# Altium schematic sheet Procesador Principal.SchDoc
size A4
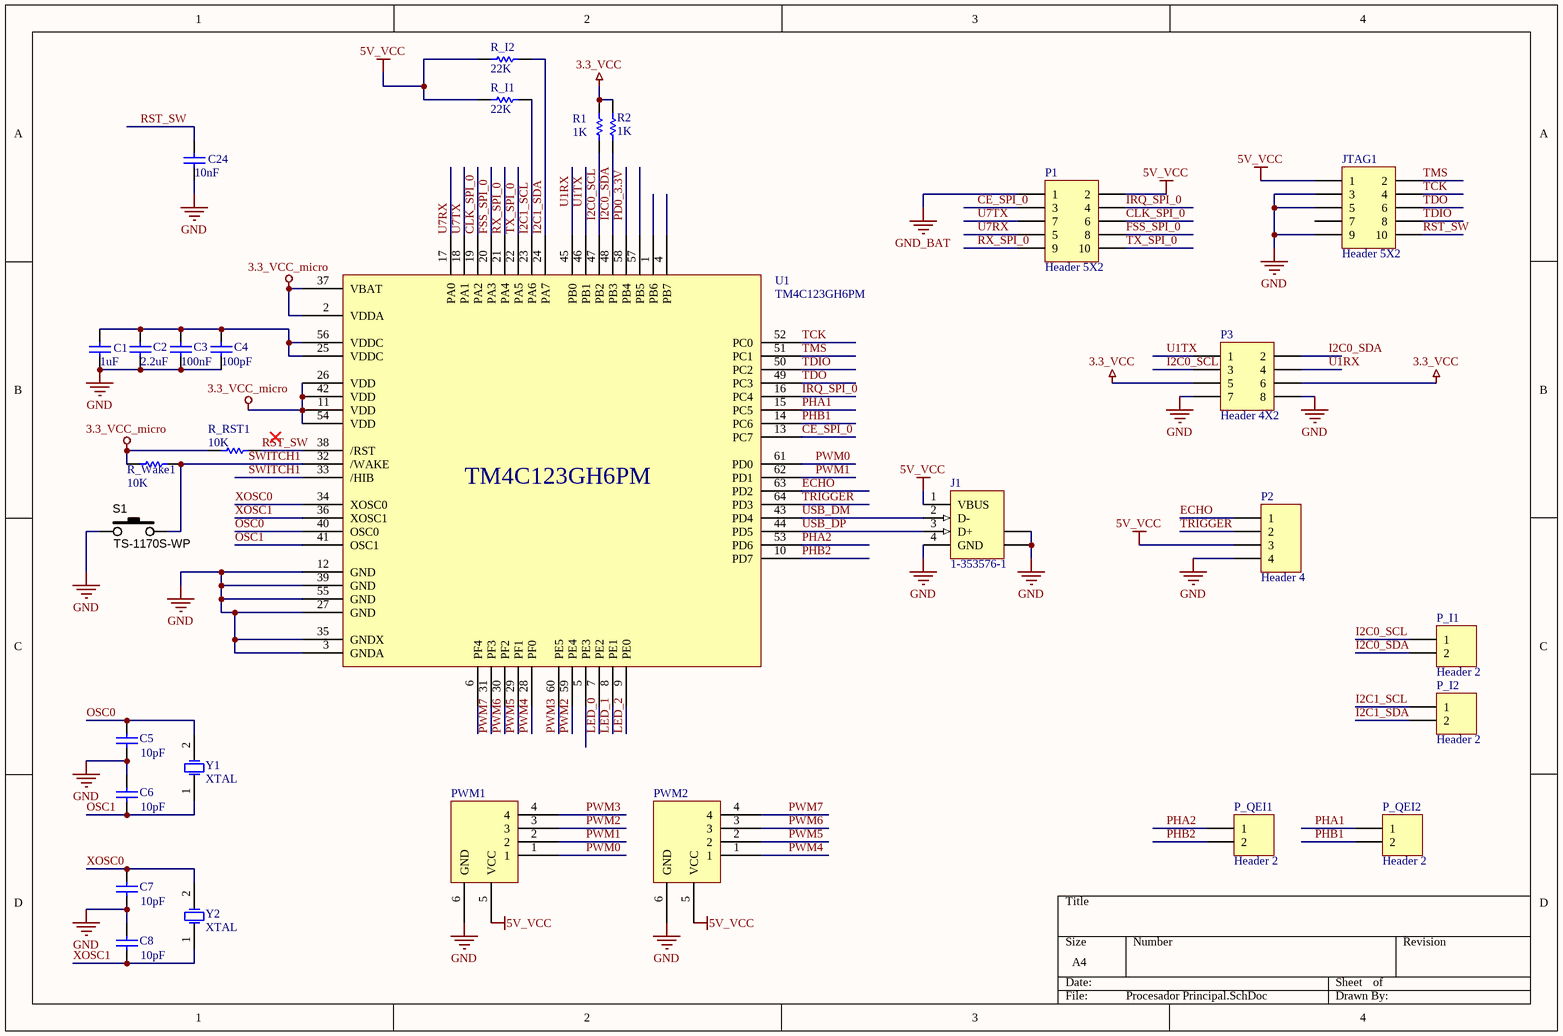
[diagram p0: Procesador Principal.SchDoc]

## Parts
C1  value 1uF  [6-0805_L]  (hidden comment: Cap)
C2  value 2.2uF  [6-0805_L]  (hidden comment: Cap)
C3  value 100nF  [6-0805_L]  (hidden comment: Cap)
C4  value 100pF  [6-0805_L]  (hidden comment: Cap)
C5  value 10pF  [C0805]  (hidden comment: Cap)
C6  value 10pF  [C0805]  (hidden comment: Cap)
C7  value 10pF  [C0805]  (hidden comment: Cap)
C8  value 10pF  [C0805]  (hidden comment: Cap)
C24  value 10nF  [6-0805_L]  (hidden comment: Cap)
J1  1-353576-1  [Micro USB]
JTAG1  Header 5X2  [HDR2X5]
P1  Header 5X2  [SMD_HEADER 5x2]
P2  Header 4  [HDR1X4]
P3  Header 4X2  [SMD_HEADER 4x2]
P_I1  Header 2  [HDR1X2]
P_I2  Header 2  [HDR1X2]
P_QEI1  Header 2  [HDR1X2]
P_QEI2  Header 2  [HDR1X2]
PWM1  Header 4 x 3  [Header_4x3_mirror]  (value not drawn)
PWM2  Header 4 x 3  [Header_4x3]  (value not drawn)
R1  value 1K  [C0805]  (hidden comment: Res1)
R2  value 1K  [6-0805_L]  (hidden comment: Res1)
R_I1  value 22K  [C1206]  (hidden comment: Res1)
R_I2  value 22K  [C1206]  (hidden comment: Res1)
R_RST1  value 10K  [C1206]  (hidden comment: Res1)
R_Wake1  value 10K  [C0805]  (hidden comment: Res1)
S1  TS-1170S-WP  [TS-1170S]
U1  TM4C123GH6PM  [SQFP50P1200X1200-64L]
Y1  XTAL  [CFPX-5]
Y2  XTAL  [BCY-W2/D2.1]

## Nets
3.3_VCC: P3.5 P3.6 R1.1 R2.2
3.3_VCC_micro: R_RST1.1 R_Wake1.1 U1.2(VDDA) U1.11(VDD) U1.26(VDD) U1.37(VBAT) U1.42(VDD) U1.54(VDD)
5V_VCC: J1.1(VBUS) JTAG1.1 P1.2 P2.3 PWM1.5(VCC) PWM2.5(VCC) R_I1.2 R_I2.2
GND: C1.1 C2.1 C3.1 C4.1 C5.1 C6.2 C7.1 C8.2 C24.1 J1.4(GND) J1.5(SHLD) J1.6(SHLD) JTAG1.3 JTAG1.5 JTAG1.9 P2.4 P3.7 P3.8 PWM1.6(GND) PWM2.6(GND) S1.1 U1.3(GNDA) U1.12(GND) U1.27(GND) U1.35(GNDX) U1.39(GND) U1.55(GND)
GND_BAT: P1.1
CE_SPI_0: P1.3 U1.13(PC7)
CLK_SPI_0: P1.6 U1.19(PA2)
ECHO: P2.1 U1.63(PD2)
FSS_SPI_0: P1.8 U1.20(PA3)
I2C0_SCL: P3.3 P_I1.1 R1.2 U1.47(PB2)
I2C0_SDA: P3.2 P_I1.2 R2.1 U1.48(PB3)
I2C1_SCL: P_I2.1 R_I1.1 U1.23(PA6)
I2C1_SDA: P_I2.2 R_I2.1 U1.24(PA7)
IRQ_SPI_0: P1.4 U1.16(PC4)
LED_0: U1.7(PE2)
LED_1: U1.8(PE1)
LED_2: U1.9(PE0)
OSC0: C5.2 U1.40(OSC0) Y1.2(OSC2)
OSC1: C6.1 U1.41(OSC1) Y1.1(OSC1)
PD0_3.3V: U1.58(PB4)
PHA1: P_QEI2.1 U1.15(PC5)
PHA2: P_QEI1.1 U1.53(PD6)
PHB1: P_QEI2.2 U1.14(PC6)
PHB2: P_QEI1.2 U1.10(PD7)
PWM0: PWM1.1 U1.61(PD0)
PWM1: PWM1.2 U1.62(PD1)
PWM2: PWM1.3 U1.59(PE4)
PWM3: PWM1.4 U1.60(PE5)
PWM4: PWM2.1 U1.28(PF0)
PWM5: PWM2.2 U1.29(PF1)
PWM6: PWM2.3 U1.30(PF2)
PWM7: PWM2.4 U1.31(PF3)
RST_SW: C24.2 JTAG1.10 R_RST1.2 U1.38(/RST)
RX_SPI_0: P1.9 U1.21(PA4)
SWITCH1: R_Wake1.2 S1.2 U1.32(/WAKE) U1.33(/HIB)
TCK: JTAG1.4 U1.52(PC0)
TDIO: JTAG1.8 U1.50(PC2)
TDO: JTAG1.6 U1.49(PC3)
TMS: JTAG1.2 U1.51(PC1)
TRIGGER: P2.2 U1.64(PD3)
TX_SPI_0: P1.10 U1.22(PA5)
U1RX: P3.4 U1.45(PB0)
U1TX: P3.1 U1.46(PB1)
U7RX: P1.5 U1.17(PA0)
U7TX: P1.7 U1.18(PA1)
USB_DM: J1.2(D-) U1.43(PD4)
USB_DP: J1.3(D+) U1.44(PD5)
XOSC0: C7.2 U1.34(XOSC0) Y2.2(OSC2)
XOSC1: C8.1 U1.36(XOSC1) Y2.1(OSC1)
NetC1_2: C1.2 C2.2 C3.2 C4.2 U1.25(VDDC) U1.56(VDDC)

Not connected (* = marked no-connect by the designer): JTAG1 7; U1 1(PB6) 4(PB7) 5(PE3) 6(PF4) 57(PB5)

## Library data of the parts
C1-C8 C24 = Cap: Capacitor; Published: 8-Jun-2000; LatestRevisionDate: 17-Jul-2002; LatestRevisionNote: Re-released for DXP Platform.; PackageReference: RAD-0.3; Publisher: Altium Limited; PackageDescription: Radial Cap, Thru-Hole; 2 Leads; 0.3 in Pin Spacing
J1 = 1-353576-1: USB 1.1, Right Angle, SMT, A Type, Receptacle, 4 Position, White; ContactMaterial: Copper Alloy; ContactPlating: Gold over Palladium Nickel; PCB_Layout: Complies with manufacturer's recommendation.; DrillSize: Corresponds to nominal value.; PanelGround: Without; Published: 15-Jul-2004; DatasheetDocument: 11-Apr-2003; PackageDocument: 11-Apr-2003; PackageReference: 353576; Publisher: Altium Limited; HousingMaterial: Thermoplastic; ComponentLink1Description: Manufacturer Link; ComponentLink1URL: http://www.tycoelectronics.com/; ComponentLink2Description: Packaging Specification; ComponentLink2URL: http://ecommas.tycoelectronics.com/commerce/DocumentDelivery/DDEController?Action=showdoc&DocId=Customer+Drawing%7F353576%7FD%7Ftif%7FJapanese%7FJPN_CD_353576_D.tif
JTAG1 P1 = Header 5X2: Header, 5-Pin, Dual row; LatestRevisionDate: 17-Jul-2002; LatestRevisionNote: Re-released for DXP Platform.; Publisher: Altium Limited
P2 = Header 4: Header, 4-Pin; LatestRevisionDate: 17-Jul-2002; LatestRevisionNote: Re-released for DXP Platform.; Publisher: Altium Limited
P3 = Header 4X2: Header, 4-Pin, Dual row; LatestRevisionDate: 17-Jul-2002; LatestRevisionNote: Re-released for DXP Platform.; Publisher: Altium Limited
P_I1 P_I2 P_QEI1 P_QEI2 = Header 2: Header, 2-Pin; LatestRevisionDate: 17-Jul-2002; LatestRevisionNote: Re-released for DXP Platform.; Publisher: Altium Limited
R1 R2 R_I1 R_I2 R_RST1 R_Wake1 = Res1: Resistor; Published: 8-Jun-2000; LatestRevisionDate: 17-Jul-2002; LatestRevisionNote: Re-released for DXP Platform.; PackageReference: AXIAL-0.3; Publisher: Altium Limited; PackageDescription: Axial Device, Thru-Hole; 2 Leads; 0.3 in Pin Spacing
S1 = SW_SMD_PB_7.0mm: Switch SMD Tact 7.0mm Stem; Manufacturer 1: Bond-Tact; Manufacturer Part Number 1: TS-1170S-WP-200; SCDType: source; Function: On/Off; Package / Case: 6.5x6.5mm; 7.0mm stem; ComponentLink1URL: http://www.bondtact.com.hk/zaspx/productd.aspx?catno=3&subcatid=3&PageNo=2&productno=40; ComponentLink1Description: http://www.bondtact.com.hk/zaspx/productd.aspx?catno=3&subcatid=3&PageNo=2&productno=40
Y1 Y2 = XTAL: Crystal Oscillator; Published: 8-Jun-2000; LatestRevisionDate: 17-Jul-2002; LatestRevisionNote: Re-released for DXP Platform.; PackageReference: R38; Publisher: Altium Limited; PackageDescription: Crystal, Thru-Hole; 2 Leads; Body 3.1 x 8.2 mm (Dia.xH)